# Altium schematic sheet IrRC_Transceiver.SchDoc
size A; DocumentNumber: 1; SheetNumber: 1; SheetTotal: 1
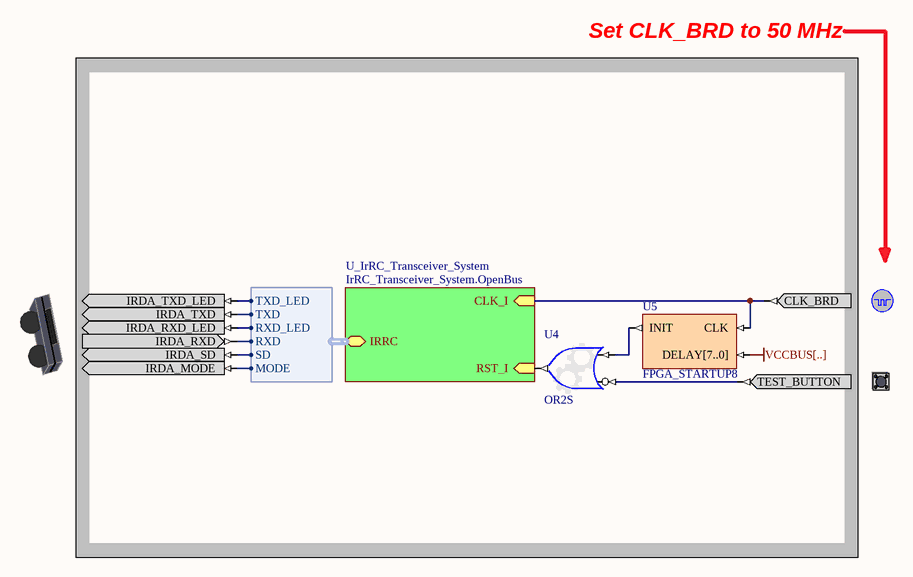
[diagram p0: IrRC_Transceiver.SchDoc]

## Parts
(Parts that share a designator on the sheet are numbered #1, #2 ... from top to bottom, then left to right.)
?#1  IRDA  (value not drawn)
?#2  CLOCK_BOARD  (value not drawn)
?#3  TEST_BUTTON  (value not drawn)
U4  OR2S
U5  FPGA_STARTUP8

## Blocks framed on the sheet
Set CLK_BRD to 50 MHz: ?#1-?#3 U4 U5

## Sub-sheets
U_IrRC_Transceiver_System = IrRC_Transceiver_System.OpenBus: CLK_I (in), RST_I (in), IRRC (harness WB_IRRC)

## Harnesses
WB_IRRC: TXD_LED, TXD, RXD_LED, RXD, SD, MODE

## Nets
VCCBUS[..]: U5.DELAY[7..0]
Net?#1_IRDA_MODE: ?#1.IRDA_MODE ; sheet U_IrRC_Transceiver_System/IRRC.MODE
Net?#1_IRDA_RXD: ?#1.IRDA_RXD ; sheet U_IrRC_Transceiver_System/IRRC.RXD
Net?#1_IRDA_RXD_LED: ?#1.IRDA_RXD_LED ; sheet U_IrRC_Transceiver_System/IRRC.RXD_LED
Net?#1_IRDA_SD: ?#1.IRDA_SD ; sheet U_IrRC_Transceiver_System/IRRC.SD
Net?#1_IRDA_TXD: ?#1.IRDA_TXD ; sheet U_IrRC_Transceiver_System/IRRC.TXD
Net?#1_IRDA_TXD_LED: ?#1.IRDA_TXD_LED ; sheet U_IrRC_Transceiver_System/IRRC.TXD_LED
Net?#2_CLK_BRD: ?#2.CLK_BRD U5.CLK ; sheet U_IrRC_Transceiver_System/CLK_I
Net?#3_TEST_BUTTON: ?#3.TEST_BUTTON U4.I1
NetU4_I0: U4.I0 U5.INIT
NetU4_O: U4.O ; sheet U_IrRC_Transceiver_System/RST_I

## Notes on the sheet
- Title
- Size:
- Date:
- A
- Number:
- Time:
- Revision:
- Sheet
- of
- File:

## Library data of the parts
?#1 = IRDA: 4 Mbits/s IRDA; PortComponent: True; Published: 22-Jan-2007; Publisher: Altium Limited; HelpURL: TR0147 Technical Reference for Altium's USB-IrDA-Ethernet Peripheral Board PB03.pdf#page=10
?#2 = CLOCK_BOARD: Global System Clock Supply; PortComponent: True; Published: 19-Nov-2003; Publisher: Altium Limited; HelpURL: TR0143 Technical Reference Manual for Altium's Desktop NanoBoard NB2DSK01.pdf#page=41; UseInDSF: True
?#3 = TEST_BUTTON: Test / Reset Button; PortComponent: True; Published: 19-Nov-2003; Publisher: Altium Limited; HelpURL: TR0143 Technical Reference Manual for Altium's Desktop NanoBoard NB2DSK01.pdf#page=53
U4 = GATE: Configurable Generic Gate; ConfiguratorName: GENERIC_GATE; ConfigurationParameters: {}Version[1.0]{}GateKind[OR]{}BusInput[False]{}GateInputType[Bit]{}GateOutputOption[Normal]{}BusWidth[8]{}RegisterOutputs[False]{}NegativeClockEdge[False]{}InputCount[2]{}InputInvert0[False]{}InputInvert1[True]{}; LastRevisionNo: 1.00.00; Published: 3-Sep-2008; Publisher: Altium Limited
U5 = FPGA_STARTUP8: FPGA Startup With 8 Bit Delay; Published: 9-Dec-2004; Publisher: Altium Limited; HelpURL: CR0119 FPGA_STARTUPx Powerup Delay Unit.pdf; LastRevisionNo: 1.00.00; ComponentLink1Description: Core &Resource Usage; ComponentLink1URL: CR0139 FPGA Peripheral Resource Usage.pdf#page=11